# EAGLE design Pinduino-Nano-WPC-TPL521-v0.3c (EAGLE 7.3.0)
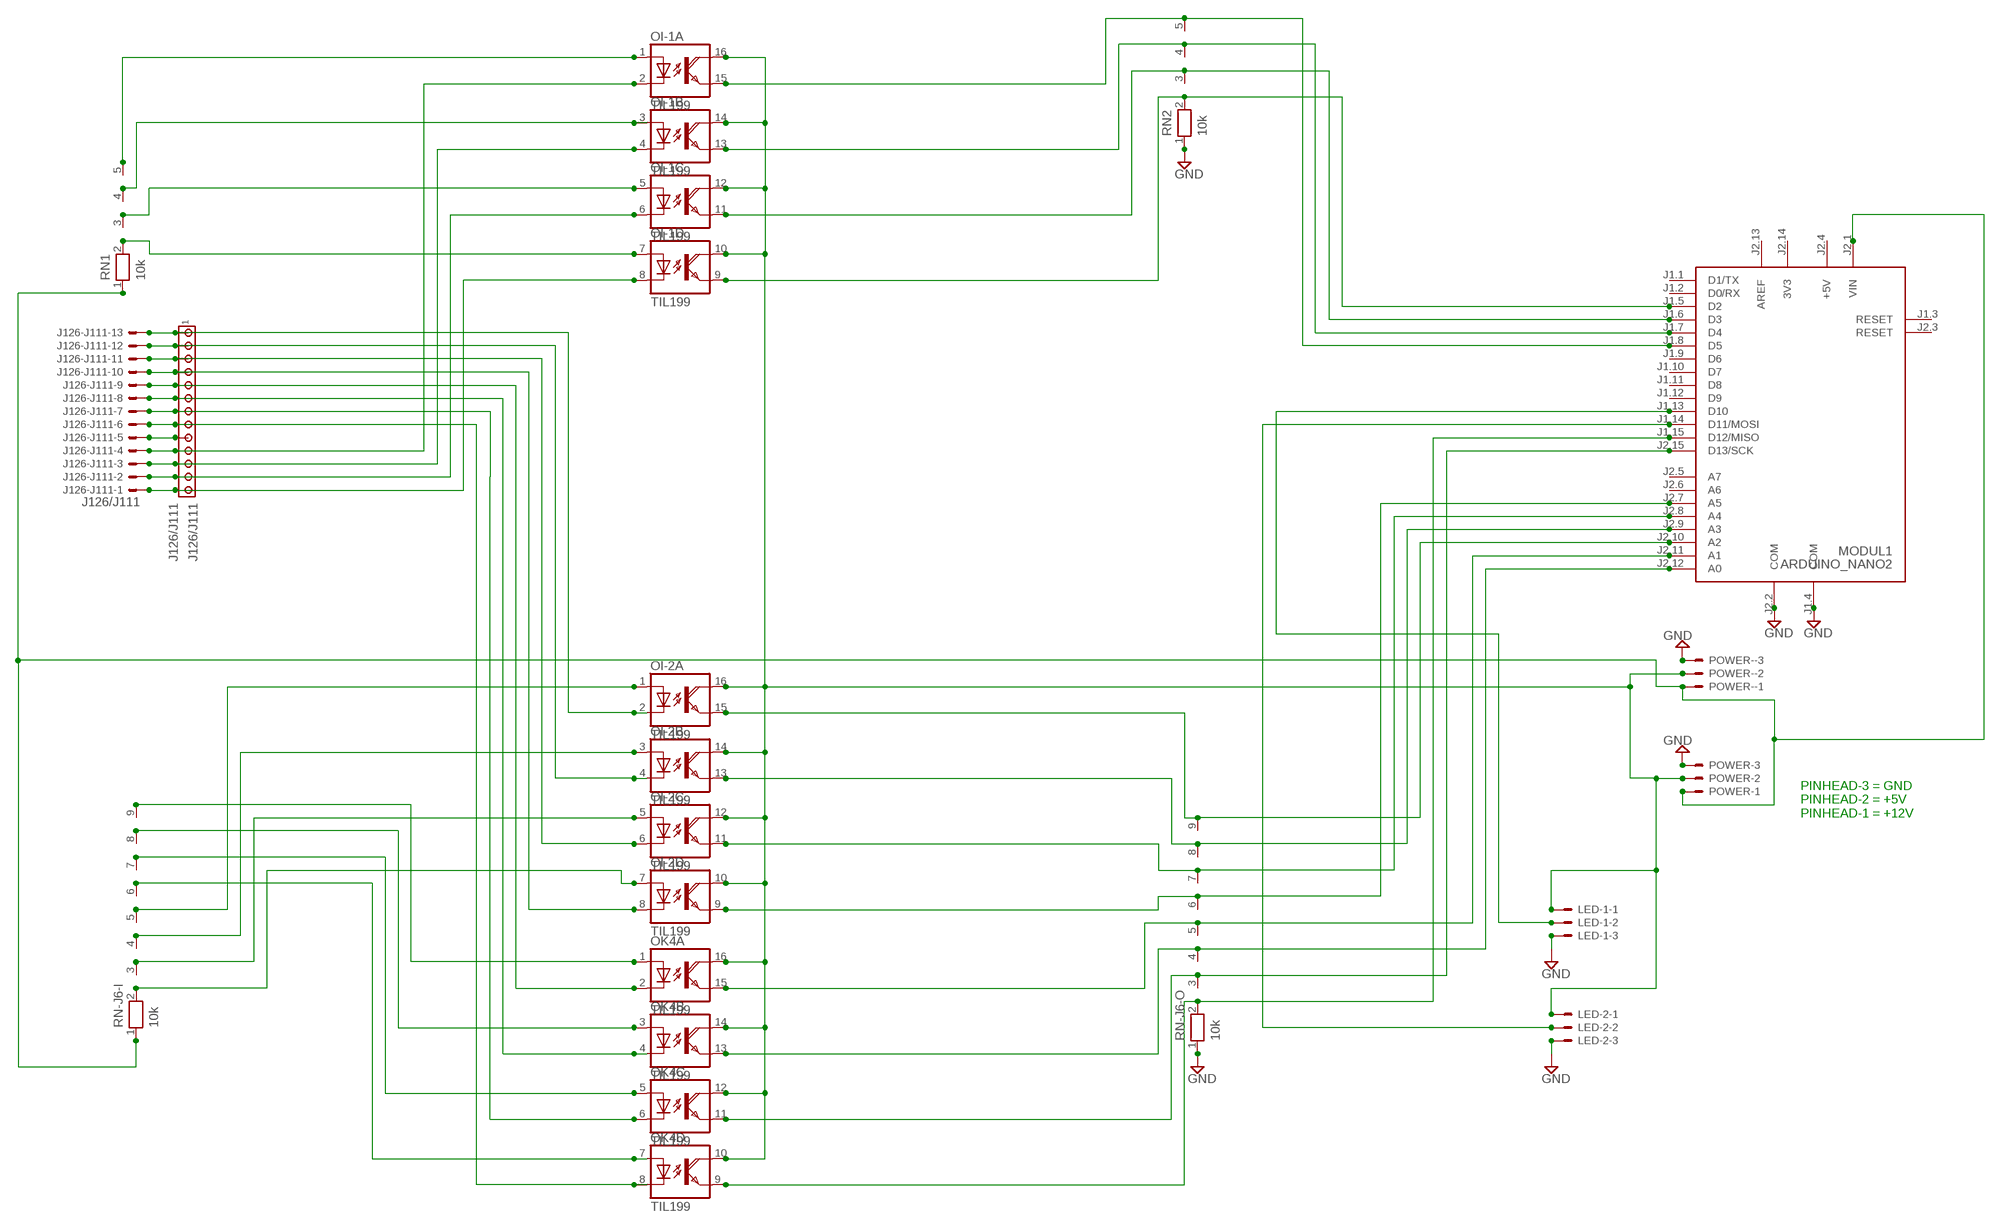
[diagram p0: schematic, sheet 1]

## Parts
J126-J111  J126/J111  KK-156-13  [KK-156-13]
J126/J111  J126/J111  MTA13-156  [1X13MTA]
LED-1  22-23-2031  [22-23-2031]
LED-2  22-23-2031  [22-23-2031]
MODUL1  ARDUINO_NANO2  [ARDUINO_NANO2]
OI-1  TIL199  [DIL16]
OI-2  TIL199  [DIL16]
OK4  TIL199  [DIL16]
POWER  22-23-2031  [22-23-2031]
POWER-  22-23-2031  [22-23-2031]
RN1  10k  RN04  [RN-5]
RN2  10k  RN04  [RN-5]
RN-J6-I  10k  RN08  [RN-9]
RN-J6-O  10k  RN08  [RN-9]

## Nets
ARD+5V [Power]: LED-1.1 LED-2.1 OI-1.10(D:COL) OI-1.12(C:COL) OI-1.14(B:COL) OI-1.16(A:COL) OI-2.10(D:COL) OI-2.12(C:COL) OI-2.14(B:COL) OI-2.16(A:COL) OK4.10(D:COL) OK4.12(C:COL) OK4.14(B:COL) OK4.16(A:COL) POWER-.2 POWER.2
GND: LED-1.3 LED-2.3 MODUL1.J1.4(COM) MODUL1.J2.2(COM) POWER-.3 POWER.3 RN2.1 RN-J6-O.1
N$1: MODUL1.J2.1(VIN) POWER-.1 POWER.1 RN1.1 RN-J6-I.1
N$2: MODUL1.J1.5(D2) OI-1.9(D:EMI) RN2.2
N$4: OI-1.5(C:A) RN1.3
N$6: OI-1.1(A:A) RN1.5
N$7: OI-1.3(B:A) RN1.4
N$13: OI-1.7(D:A) RN1.2
N$18: MODUL1.J1.6(D3) OI-1.11(C:EMI) RN2.3
N$19: J126-J111.3 J126/J111.11 OI-1.4(B:C)
N$20: J126-J111.2 J126/J111.12 OI-1.6(C:C)
N$21: J126-J111.12 J126/J111.2 OI-2.4(B:C)
N$22: J126-J111.13 J126/J111.1 OI-2.2(A:C)
N$23: J126-J111.4 J126/J111.10 OI-1.2(A:C)
N$25: J126-J111.1 J126/J111.13 OI-1.8(D:C)
N$27: J126-J111.9 J126/J111.5 OK4.2(A:C)
N$28: MODUL1.J1.7(D4) OI-1.13(B:EMI) RN2.4
N$29: OK4.1(A:A) RN-J6-I.9
N$30: OK4.3(B:A) RN-J6-I.8
N$31: OK4.5(C:A) RN-J6-I.7
N$32: OI-2.3(B:A) RN-J6-I.4
N$33: OI-2.1(A:A) RN-J6-I.5
N$34: OI-2.5(C:A) RN-J6-I.3
N$35: OK4.7(D:A) RN-J6-I.6
N$36: MODUL1.J2.8(A4) OI-2.11(C:EMI) RN-J6-O.7
N$37: OI-2.7(D:A) RN-J6-I.2
N$38: MODUL1.J2.7(A5) OI-2.9(D:EMI) RN-J6-O.6
N$39: MODUL1.J2.15(D13/SCK) OK4.11(C:EMI) RN-J6-O.3
N$42: MODUL1.J2.12(A0) OK4.13(B:EMI) RN-J6-O.4
N$43: MODUL1.J2.11(A1) OK4.15(A:EMI) RN-J6-O.5
N$44: LED-2.2 MODUL1.J1.14(D11/MOSI)
N$45: LED-1.2 MODUL1.J1.13(D10)
N$51: MODUL1.J1.8(D5) OI-1.15(A:EMI) RN2.5
N$55: MODUL1.J2.9(A3) OI-2.13(B:EMI) RN-J6-O.8
N$56: MODUL1.J2.10(A2) OI-2.15(A:EMI) RN-J6-O.9
N$58: J126-J111.6 J126/J111.8 OK4.8(D:C)
N$59: J126-J111.7 J126/J111.7 OK4.6(C:C)
N$60: MODUL1.J1.15(D12/MISO) OK4.9(D:EMI) RN-J6-O.2
N$62: J126-J111.8 J126/J111.6 OK4.4(B:C)
N$64: J126-J111.5 J126/J111.9
N$65: J126-J111.10 J126/J111.4 OI-2.8(D:C)
N$66: J126-J111.11 J126/J111.3 OI-2.6(C:C)
Unconnected: MODUL1.J1.1(D1/TX) MODUL1.J1.2(D0/RX) MODUL1.J1.3(RESET) MODUL1.J1.9(D6) MODUL1.J1.10(D7) MODUL1.J1.11(D8) MODUL1.J1.12(D9) MODUL1.J2.3(RESET) MODUL1.J2.5(A7) MODUL1.J2.6(A6)

## Notes on the sheet
- PINHEAD-3 = GND
  PINHEAD-2 = +5V
  PINHEAD-1 = +12V

## Power pins joined to a net without a drawn wire
3V3: MODUL1.J2.14(3V3)
+5V: MODUL1.J2.4(+5V)
AREF: MODUL1.J2.13(AREF)

## Library data of the parts
J126-J111 = con-molex:KK-156-13: KK 156 HEADER Source: http://www.molex.com/pdm_docs/sd/026604100_sd.pdf; OC_FARNELL: unknown; OC_NEWARK: unknown
J126/J111 = con-amp:MTA13-156: AMP connector
LED-1 LED-2 POWER POWER- = con-molex:22-23-2031: .100" (2.54mm) Center Header - 3 Pin; MF: MOLEX; MPN: 22-23-2031; OC_FARNELL: 1462950; OC_NEWARK: 30C0862
MODUL1 = arduino:ARDUINO_NANO2: Arduino Nano2 Auto generated by modulcreator.ulp \;; ANZAHL: 2; MODUL: TRUE; STECKX0: -76200; STECKX1: 76200; STECKY0: 177800; STECKY1: 177800
OI-1 OI-2 OK4 = optocoupler:TIL199: TEXAS INSTRUMENTS OPTO COUPLER; MPN: TIL 199; OC_FARNELL: 1683370; OC_NEWARK: 05R6483
RN1 RN2 = resistor-net:RN04: RESISTOR NETWORK; OC_FARNELL: unknown; OC_NEWARK: unknown
RN-J6-I RN-J6-O = resistor-net:RN08: RESISTOR NETWORK; OC_FARNELL: unknown; OC_NEWARK: unknown

## Net classes
0 default: width 0.406 mm
1 Power: width 0.61 mm
2 GND: width 0.61 mm

## Board
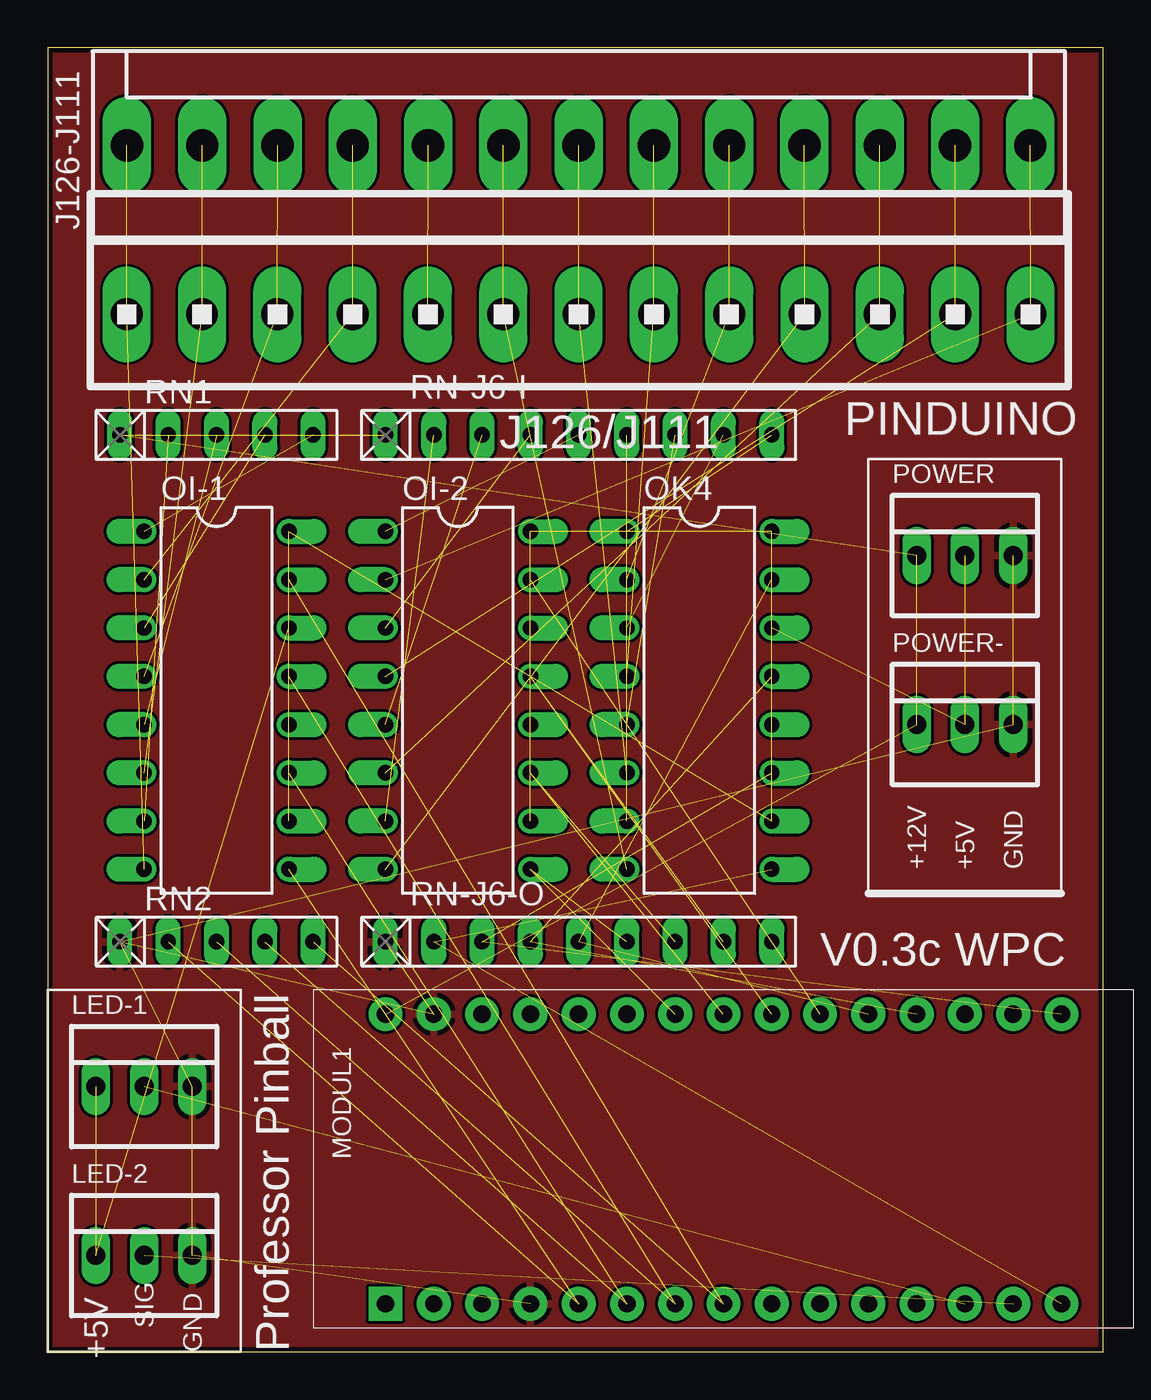
[diagram p1: board, top side]
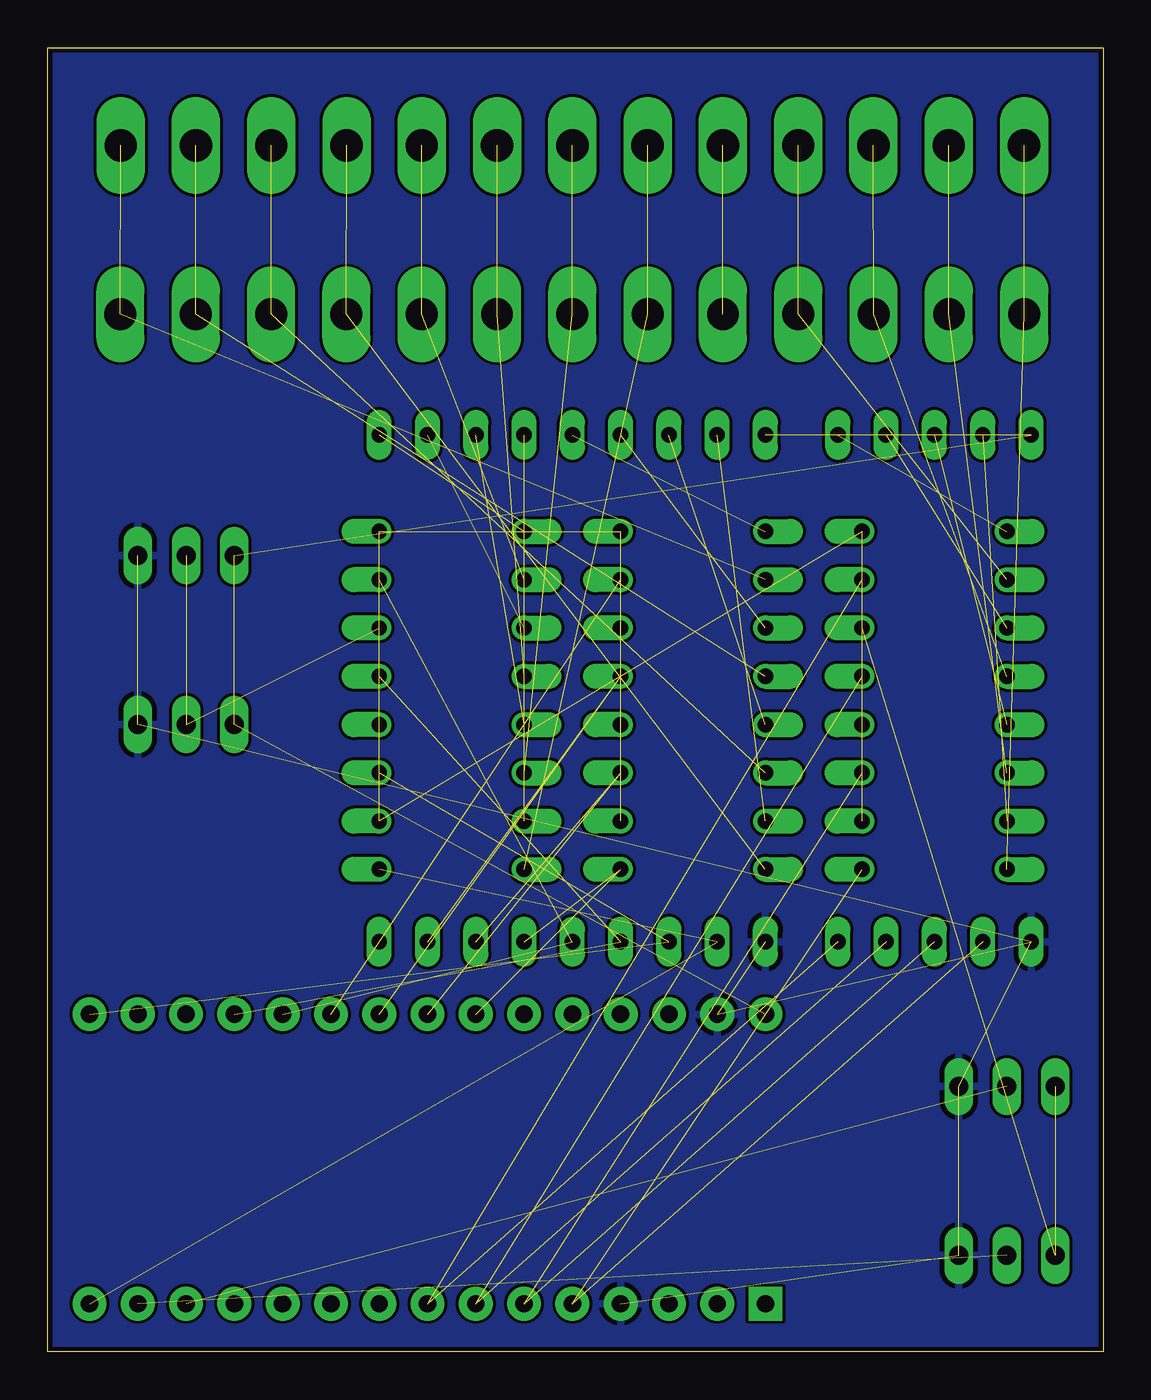
[diagram p2: board, bottom side, seen from below]

Size 55.55 x 68.65 mm. Coordinates in mm from the lower left corner, seen from the top.
Outline: 0,0 55.55,0 55.55,68.65 0,68.65 0,0
Copper layers (1*16): Top 0.035mm / dielectric 1.5mm / Bottom 0.035mm
Design rules "SeeedStudio_2layer_DRU_no_angle_20140221": minimum track width 6mil, minimum drill 12mil, track to track 6mil, track to pad 6mil, pad to pad 6mil, via to via 6mil, smd to smd 0mil, copper to edge 10mil, drill to drill 10mil, minimum pad ring 10mil, minimum via ring 6mil, stop-mask expansion 2mil, vias tented up to drill 100mil, thermal gap 10mil

### Footprints (pad centres in the part's own frame; a part is rotated, then mirrored left to right if it is on the bottom)
KK-156-13 = drill 1.7 pad 2.184 long: 1 -23.76,0; 2 -19.8,0; 3 -15.84,0; 4 -11.88,0; 5 -7.92,0; 6 -3.96,0; 7 0,0; 8 3.96,0; 9 7.92,0; 10 11.88,0; 11 15.84,0; 12 19.8,0; 13 23.76,0
1X13MTA = drill 1.676 long: 1 23.774,0; 2 19.812,0; 3 15.85,0; 4 11.887,0; 5 7.925,0; 6 3.962,0; 7 0,0; 8 -3.962,0; 9 -7.925,0; 10 -11.887,0; 11 -15.85,0; 12 -19.812,0; 13 -23.774,0
22-23-2031 = drill 1 long: 1 -2.54,0; 2 0,0; 3 2.54,0
ARDUINO_NANO2 = drill 0.914 pad 1.778 square: J1.1 -7.62,17.78 | drill 0.914 pad 1.778: J1.2 -7.62,15.24; J1.3 -7.62,12.7; J1.4 -7.62,10.16; J1.5 -7.62,7.62; J1.6 -7.62,5.08; J1.7 -7.62,2.54; J1.8 -7.62,0; J1.9 -7.62,-2.54; J1.10 -7.62,-5.08; J1.11 -7.62,-7.62; J1.12 -7.62,-10.16; J1.13 -7.62,-12.7; J1.14 -7.62,-15.24; J1.15 -7.62,-17.78; J2.1 7.62,17.78; J2.2 7.62,15.24; J2.3 7.62,12.7; J2.4 7.62,10.16; J2.5 7.62,7.62; J2.6 7.62,5.08; J2.7 7.62,2.54; J2.8 7.62,0; J2.9 7.62,-2.54; J2.10 7.62,-5.08; J2.11 7.62,-7.62; J2.12 7.62,-10.16; J2.13 7.62,-12.7; J2.14 7.62,-15.24; J2.15 7.62,-17.78
DIL16 = drill 0.813 offset: 1 -8.89,-3.81; 2 -6.35,-3.81; 3 -3.81,-3.81; 4 -1.27,-3.81; 5 1.27,-3.81; 6 3.81,-3.81; 7 6.35,-3.81; 8 8.89,-3.81; 9 8.89,3.81; 10 6.35,3.81; 11 3.81,3.81; 12 1.27,3.81; 13 -1.27,3.81; 14 -3.81,3.81; 15 -6.35,3.81; 16 -8.89,3.81
RN-5 = drill 0.813 long: 1 -5.08,0; 2 -2.54,0; 3 0,0; 4 2.54,0; 5 5.08,0
RN-9 = drill 0.813 long: 1 -10.16,0; 2 -7.62,0; 3 -5.08,0; 4 -2.54,0; 5 0,0; 6 2.54,0; 7 5.08,0; 8 7.62,0; 9 10.16,0

### Placement (x,y rotation side)
J126-J111  27.94,63.5 0 top
J126/J111  27.94,54.61 0 top
LED-1  5.08,13.97 0 top
LED-2  5.08,5.08 0 top
MODUL1  35.56,10.16 90 top
OI-1  8.89,34.29 270 top
OI-2  21.59,34.29 270 top
OK4  34.29,34.29 270 top
POWER  48.26,41.91 0 top
POWER-  48.26,33.02 0 top
RN1  8.89,48.26 0 top
RN2  8.89,21.59 0 top
RN-J6-I  27.94,48.26 0 top
RN-J6-O  27.94,21.59 0 top

### Tracks (layer width: path | path; a pad name or v marks a point on that pad's centre or on a via)
ARD+5V  (15 unrouted)
GND  (7 unrouted)
  pour Top: -1.27,69.85 -1.27,-2.54 58.42,-2.54 58.42,69.85
  pour Bottom: -2.54,71.12 -2.54,-3.81 57.15,-3.81 57.15,71.12
N$1  (4 unrouted)
N$2  (2 unrouted)
N$4  (1 unrouted)
N$6  (1 unrouted)
N$7  (1 unrouted)
N$13  (1 unrouted)
N$18  (2 unrouted)
N$19  (2 unrouted)
N$20  (2 unrouted)
N$21  (2 unrouted)
N$22  (2 unrouted)
N$23  (2 unrouted)
N$25  (2 unrouted)
N$27  (2 unrouted)
N$28  (2 unrouted)
N$29  (1 unrouted)
N$30  (1 unrouted)
N$31  (1 unrouted)
N$32  (1 unrouted)
N$33  (1 unrouted)
N$34  (1 unrouted)
N$35  (1 unrouted)
N$36  (2 unrouted)
N$37  (1 unrouted)
N$38  (2 unrouted)
N$39  (2 unrouted)
N$42  (2 unrouted)
N$43  (2 unrouted)
N$44  (1 unrouted)
N$45  (1 unrouted)
N$51  (2 unrouted)
N$55  (2 unrouted)
N$56  (2 unrouted)
N$58  (2 unrouted)
N$59  (2 unrouted)
N$60  (2 unrouted)
N$62  (2 unrouted)
N$64  (1 unrouted)
N$65  (2 unrouted)
N$66  (2 unrouted)

### Text on the board
tNames: PINDUINO | +5V | +12V | GND | V0.3c WPC | +5V | SIG | GND | Professor Pinball